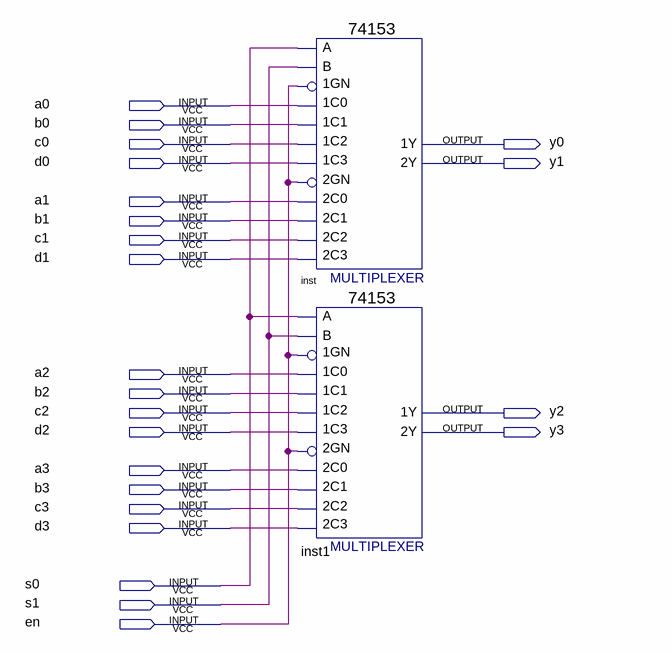
[diagram p0: schematic sheet]
// Quartus schematic q4bit_4mux.bdf as structural Verilog: 2 symbols, 23 pins
module q4bit_4mux (
  input  a0,
  input  b0,
  input  c0,
  input  d0,
  input  a1,
  input  b1,
  input  c1,
  input  d1,
  input  a2,
  input  b2,
  input  c2,
  input  d2,
  input  a3,
  input  b3,
  input  c3,
  input  d3,
  input  s0,
  input  s1,
  input  en,
  output y0,
  output y1,
  output y2,
  output y3
);

  \74153  inst (
    .\1C1 (b0), .\1GN (en), .\1C0 (a0), .\2C0 (a1), .\2GN (en), .\2C2 (c1), .\1C2 (c0), .\1C3 (d0), .B(s1),
    .A(s0), .\2C1 (b1), .\2C3 (d1), .\1Y (y0), .\2Y (y1));
  \74153  inst1 (
    .\1C1 (b2), .\1GN (en), .\1C0 (a2), .\2C0 (a3), .\2GN (en), .\2C2 (c3), .\1C2 (c2), .\1C3 (d2), .B(s1),
    .A(s0), .\2C1 (b3), .\2C3 (d3), .\1Y (y2), .\2Y (y3));
endmodule
